# Altium schematic sheet PWR_LTM4622.SchDoc
size A3
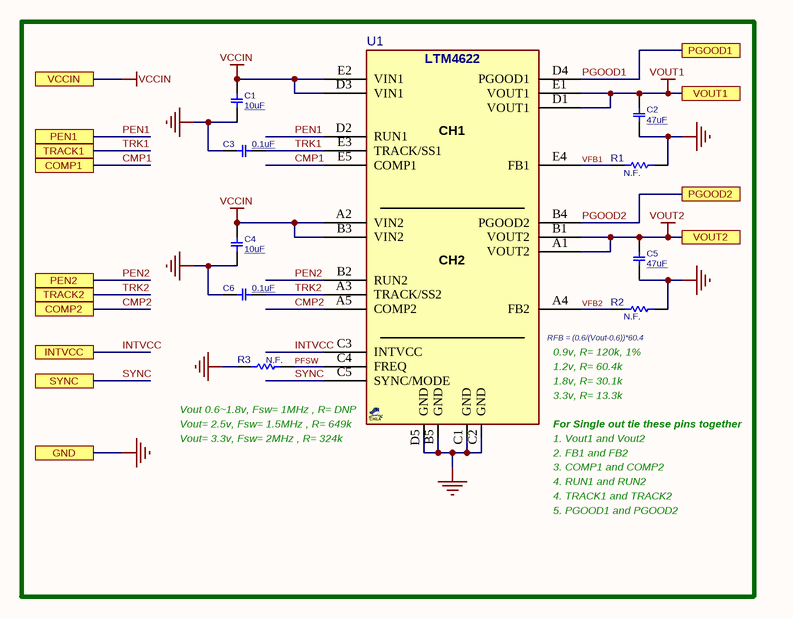
[diagram p0: PWR_LTM4622.SchDoc]

## Parts
C1  10uF  [C0805]
C2  47uF  [C0805]
C3  0.1uF  [C0402]
C4  10uF  [C0805]
C5  47uF  [C0805]
C6  0.1uF  [C0402]
R1  N.F.  [R0402]
R2  N.F.  [R0402]
R3  N.F.  [R0402]
U1  LTM4622  [BGA127_25_6262]  (value not drawn)

## Ports
COMP1, COMP2, GND, INTVCC, PEN1, PEN2, PGOOD1, PGOOD2, SYNC, TRACK1, TRACK2, VCCIN, VOUT1, VOUT2

## Nets
GND: C1.2 C2.2 C3.1 C4.2 C5.2 C6.1 R1.1 R2.1 R3.2 U1.B5(GND) U1.C1(GND) U1.C2(GND) U1.D5(GND) ; port GND
VCCIN: C1.1 C4.1 U1.A2(VIN2) U1.B3(VIN2) U1.D3(VIN1) U1.E2(VIN1) ; port VCCIN
VOUT1: C2.1 U1.D1(VOUT1) U1.E1(VOUT1) ; port VOUT1
VOUT2: C5.1 U1.A1(VOUT2) U1.B1(VOUT2) ; port VOUT2
CMP1: U1.E5(COMP1) ; port COMP1
CMP2: U1.A5(COMP2) ; port COMP2
INTVCC: U1.C3(INTVCC) ; port INTVCC
PEN1: U1.D2(RUN1) ; port PEN1
PEN2: U1.B2(RUN2) ; port PEN2
PFSW: R3.1 U1.C4(FREQ)
PGOOD1: U1.D4(PGOOD1) ; port PGOOD1
PGOOD2: U1.B4(PGOOD2) ; port PGOOD2
SYNC: U1.C5(SYNC/MODE) ; port SYNC
TRK1: C3.2 U1.E3(TRACK/SS1) ; port TRACK1
TRK2: C6.2 U1.A3(TRACK/SS2) ; port TRACK2
VFB1: R1.2 U1.E4(FB1)
VFB2: R2.2 U1.A4(FB2)

## Notes on the sheet
- (near U1) RFB = (0.6/(Vout-0.6))*60.4
- (near U1) Vout 0.6~1.8v, Fsw= 1MHz , R= DNP
- (near U1) 1.8v, R= 30.1k
- (near U1) 3.3v, R= 13.3k
- (near U1) 1.2v, R= 60.4k
- (near U1) 0.9v, R= 120k, 1%
- (near U1) Vout= 2.5v, Fsw= 1.5MHz , R= 649k
- (near U1) Vout= 3.3v, Fsw= 2MHz , R= 324k
- (near U1) For Single out tie these pins together
- (near U1) 1. Vout1 and Vout2
- (near U1) 2. FB1 and FB2
- (near U1) 3. COMP1 and COMP2
- (near U1) 4. RUN1 and RUN2
- 4. TRACK1 and TRACK2
- 5. PGOOD1 and PGOOD2
- (in symbol LTM4622_BGA25) CH1; CH2

## Library data of the parts
C1 C4 = CAP_SMD_MLCC: CAP, MLCC; PARAM: X5R, 20%; PARAM2: 25v; PRICE: 100= 1$; DESC: CAP, MLCC; MANF_P#: -; MANF: -; ASSEMBLY: ASSEMBLY; VALUE: 10uF
C2 C5 = CAP_SMD_MLCC: CAP, MLCC; PARAM: X5R, 20%; PARAM2: 6.3v; PRICE: 100= 1$; DESC: CAP, MLCC; MANF_P#: -; MANF: -; ASSEMBLY: ASSEMBLY; VALUE: 47uF
C3 C6 = CAP_SMD_MLCC: CAP, MLCC; PARAM2: 50v; PARAM: -; PRICE: 100= 1$; DESC: CAP, MLCC; MANF_P#: -; MANF: -; ASSEMBLY: ASSEMBLY; VALUE: 0.1uF
R1-R3 = RES_SMD: RESISTOR, SMD; PARAM: -W; DESC: DESCRIPTION; DIST#: MOUSER; PARAM2: 1%; MANF_P#: -; MANF: -; ASSEMBLY: ASSEMBLY; PRICE: 100= 0.5$; VALUE: N.F.
U1 = LTM4622_BGA25: DC2DC Switching MODULE, Dual, 2.5A; MANF: Analog Devices; MANF_P#: LTM4622EY, LTM4622IY; PARAM2: 3.6~20VIN, 0.6~5.5VOUT; PARAM: Dual 2.5A, –40~125°C; PRICE: -; VALUE: LTM4622